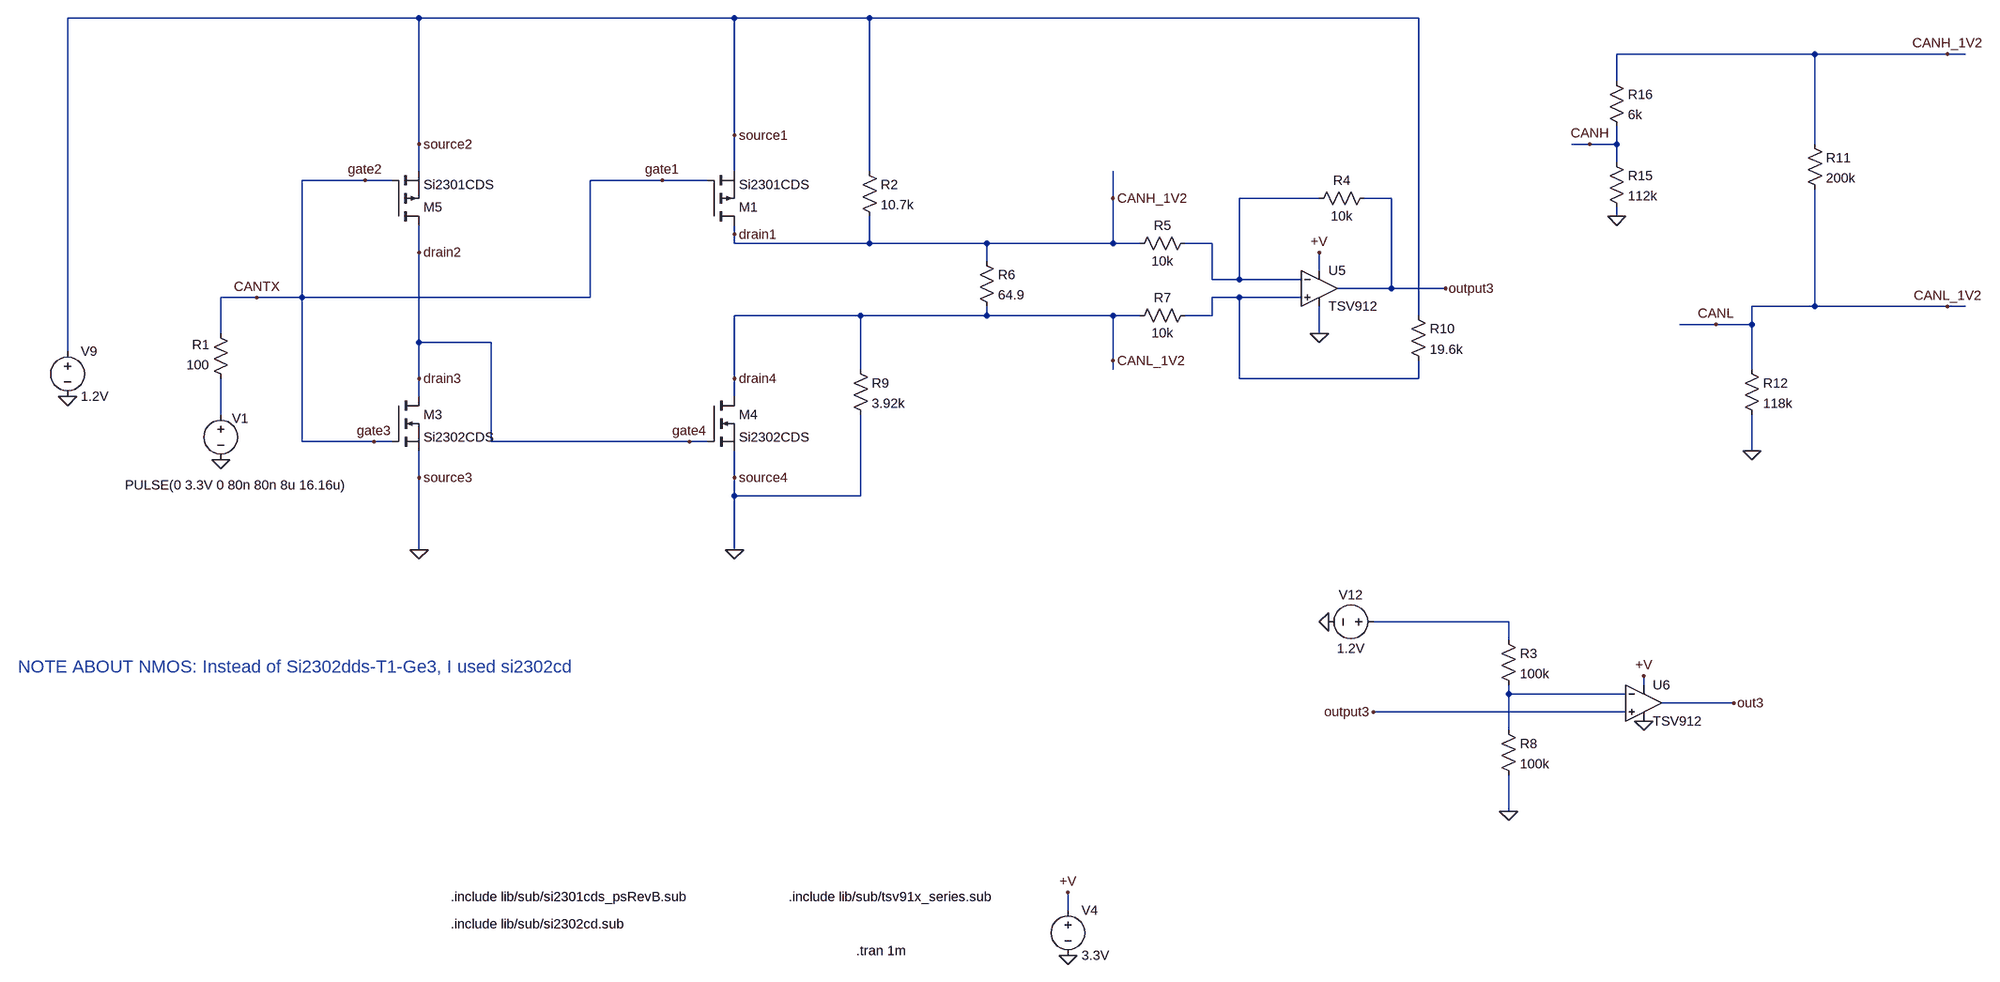
[diagram p0: schematic Simulation.asc]
Simulation.asc, the LTspice schematic file:
Version 4.1
SHEET 1 3984 680
WIRE -496 -1248 -1120 -1248
WIRE 64 -1248 -496 -1248
WIRE 304 -1248 64 -1248
WIRE 1280 -1248 304 -1248
WIRE 1984 -1184 1632 -1184
WIRE 2256 -1184 1984 -1184
WIRE 2288 -1184 2256 -1184
WIRE 1632 -1136 1632 -1184
WIRE 64 -1040 64 -1248
WIRE -496 -1024 -496 -1248
WIRE 1584 -1024 1552 -1024
WIRE 1632 -1024 1632 -1056
WIRE 1632 -1024 1584 -1024
WIRE 1984 -1024 1984 -1184
WIRE 1632 -992 1632 -1024
WIRE -496 -976 -496 -1024
WIRE 64 -976 64 -1040
WIRE 304 -976 304 -1248
WIRE -592 -960 -704 -960
WIRE -544 -960 -592 -960
WIRE -64 -960 -192 -960
WIRE 16 -960 -64 -960
WIRE 736 -928 736 -976
WIRE 1104 -928 960 -928
WIRE 1232 -928 1184 -928
WIRE 1632 -896 1632 -912
WIRE 64 -864 64 -880
WIRE 64 -848 64 -864
WIRE 304 -848 304 -896
WIRE 304 -848 64 -848
WIRE 512 -848 304 -848
WIRE 736 -848 736 -928
WIRE 736 -848 512 -848
WIRE 784 -848 736 -848
WIRE 912 -848 864 -848
WIRE -496 -832 -496 -880
WIRE 512 -816 512 -848
WIRE 1104 -800 1104 -832
WIRE 912 -784 912 -848
WIRE 960 -784 960 -928
WIRE 960 -784 912 -784
WIRE 1072 -784 960 -784
WIRE 1232 -768 1232 -928
WIRE 1232 -768 1136 -768
WIRE 1328 -768 1232 -768
WIRE -784 -752 -848 -752
WIRE -704 -752 -704 -960
WIRE -704 -752 -784 -752
WIRE -192 -752 -192 -960
WIRE -192 -752 -704 -752
WIRE 960 -752 912 -752
WIRE 1072 -752 960 -752
WIRE 1984 -736 1984 -944
WIRE 1984 -736 1872 -736
WIRE 2256 -736 1984 -736
WIRE 2288 -736 2256 -736
WIRE 288 -720 64 -720
WIRE 512 -720 512 -736
WIRE 512 -720 288 -720
WIRE 736 -720 512 -720
WIRE 784 -720 736 -720
WIRE 912 -720 912 -752
WIRE 912 -720 864 -720
WIRE 1280 -720 1280 -1248
WIRE 1808 -704 1744 -704
WIRE 1872 -704 1872 -736
WIRE 1872 -704 1808 -704
WIRE -848 -688 -848 -752
WIRE 1104 -688 1104 -736
WIRE -496 -672 -496 -832
WIRE -368 -672 -496 -672
WIRE -1120 -656 -1120 -1248
WIRE 736 -640 736 -720
WIRE 288 -624 288 -720
WIRE 736 -624 736 -640
WIRE 1872 -624 1872 -704
WIRE -496 -608 -496 -672
WIRE 64 -608 64 -720
WIRE 960 -608 960 -752
WIRE 1280 -608 1280 -640
WIRE 1280 -608 960 -608
WIRE -496 -576 -496 -608
WIRE 64 -576 64 -608
WIRE -848 -544 -848 -608
WIRE -704 -496 -704 -752
WIRE -576 -496 -704 -496
WIRE -544 -496 -576 -496
WIRE -368 -496 -368 -672
WIRE -16 -496 -368 -496
WIRE 16 -496 -16 -496
WIRE 1872 -480 1872 -544
WIRE -496 -432 -496 -480
WIRE 64 -432 64 -480
WIRE 64 -400 64 -432
WIRE 288 -400 288 -544
WIRE 288 -400 64 -400
WIRE -496 -304 -496 -432
WIRE 64 -304 64 -400
WIRE 1440 -176 1200 -176
WIRE 1440 -144 1440 -176
WIRE 1680 -64 1680 -80
WIRE 1440 -48 1440 -64
WIRE 1648 -48 1440 -48
WIRE 1840 -32 1712 -32
WIRE 1648 -16 1200 -16
WIRE 1440 16 1440 -48
WIRE 1440 160 1440 96
WIRE 656 336 656 304
FLAG 656 416 0
FLAG 656 304 +V
FLAG 1104 -688 0
FLAG 1104 -832 +V
FLAG -1120 -576 0
FLAG 1328 -768 output3
FLAG 1440 160 0
FLAG 1120 -176 0
FLAG 1680 -80 +V
FLAG 1680 0 0
FLAG 1200 -16 output3
FLAG 1840 -32 out3
FLAG 736 -640 CANL_1V2
FLAG -496 -1024 source2
FLAG -592 -960 gate2
FLAG -848 -464 0
FLAG -576 -496 gate3
FLAG -496 -432 source3
FLAG -496 -608 drain3
FLAG -496 -304 0
FLAG 64 -304 0
FLAG -784 -752 CANTX
FLAG -16 -496 gate4
FLAG 64 -608 drain4
FLAG 64 -432 source4
FLAG 64 -864 drain1
FLAG 64 -1040 source1
FLAG -64 -960 gate1
FLAG 1584 -1024 CANH
FLAG 1632 -896 0
FLAG 1872 -480 0
FLAG 1808 -704 CANL
FLAG 2256 -1184 CANH_1V2
FLAG 2256 -736 CANL_1V2
FLAG -496 -832 drain2
FLAG 736 -928 CANH_1V2
SYMBOL voltage 656 320 R0
WINDOW 123 0 0 Left 0
WINDOW 39 0 0 Left 0
SYMATTR InstName V4
SYMATTR Value 3.3V
SYMBOL res 880 -864 R90
WINDOW 0 0 56 VBottom 2
WINDOW 3 32 56 VTop 2
SYMATTR InstName R5
SYMATTR Value 10k
SYMBOL res 880 -736 R90
WINDOW 0 0 56 VBottom 2
WINDOW 3 32 56 VTop 2
SYMATTR InstName R7
SYMATTR Value 10k
SYMBOL lib\\sym\\TSV912 1104 -768 R0
SYMATTR InstName U5
SYMBOL res 1200 -944 R90
WINDOW 0 0 56 VBottom 2
WINDOW 3 32 56 VTop 2
SYMATTR InstName R4
SYMATTR Value 10k
SYMBOL res 1264 -736 R0
SYMATTR InstName R10
SYMATTR Value 19.6k
SYMBOL voltage -1120 -672 R0
WINDOW 123 0 0 Left 0
WINDOW 39 0 0 Left 0
SYMATTR InstName V9
SYMATTR Value 1.2V
SYMBOL lib\\sym\\TSV912 1680 -32 R0
SYMATTR InstName U6
SYMBOL res 1424 -160 R0
SYMATTR InstName R3
SYMATTR Value 100k
SYMBOL res 1424 0 R0
SYMATTR InstName R8
SYMATTR Value 100k
SYMBOL voltage 1216 -176 R90
WINDOW 0 -32 56 VBottom 2
WINDOW 3 32 56 VTop 2
WINDOW 123 0 0 Left 0
WINDOW 39 0 0 Left 0
SYMATTR InstName V12
SYMATTR Value 1.2V
SYMBOL res 288 -992 R0
SYMATTR InstName R2
SYMATTR Value 10.7k
SYMBOL res 272 -640 R0
SYMATTR InstName R9
SYMATTR Value 3.92k
SYMBOL res 496 -832 R0
SYMATTR InstName R6
SYMATTR Value 64.9
SYMBOL res -832 -592 R180
WINDOW 0 36 76 Left 2
WINDOW 3 36 40 Left 2
SYMATTR InstName R1
SYMATTR Value 100
SYMBOL voltage -848 -560 R0
WINDOW 0 20 23 Left 2
WINDOW 3 -170 141 Left 2
WINDOW 123 0 0 Left 0
WINDOW 39 0 0 Left 0
SYMATTR InstName V1
SYMATTR Value PULSE(0 3.3V 0 80n 80n 8u 16.16u)
SYMBOL lib\\sym\\nmos -544 -576 R0
SYMATTR InstName M3
SYMATTR Value Si2302CDS
SYMATTR Prefix X
SYMBOL lib\\sym\\nmos 16 -576 R0
SYMATTR InstName M4
SYMATTR Value Si2302CDS
SYMATTR Prefix X
SYMBOL lib\\sym\\pmos -544 -880 M180
SYMATTR InstName M5
SYMATTR Value Si2301CDS
SYMATTR Prefix X
SYMBOL res 1616 -1008 R0
SYMATTR InstName R15
SYMATTR Value 112k
SYMBOL res 1616 -1152 R0
SYMATTR InstName R16
SYMATTR Value 6k
SYMBOL res 1968 -1040 R0
SYMATTR InstName R11
SYMATTR Value 200k
SYMBOL res 1856 -640 R0
SYMATTR InstName R12
SYMATTR Value 118k
SYMBOL lib\\sym\\pmos 16 -880 M180
SYMATTR InstName M1
SYMATTR Value Si2301CDS
SYMATTR Prefix X
TEXT 280 408 Left 2 !.tran 1m
TEXT 160 312 Left 2 !.include lib/sub/tsv91x_series.sub
TEXT -440 312 Left 2 !.include lib/sub/si2301cds_psRevB.sub
TEXT -440 360 Left 2 !.include lib/sub/si2302cd.sub
TEXT -1208 -96 Left 3 ;NOTE ABOUT NMOS: Instead of Si2302dds-T1-Ge3, I used si2302cd

The netlist it stands for:
* Simulation.asc
V4 +V 0 3.3V
R5 N001 CANH_1V2 10k
R7 N002 CANL 10k
* U5: TSV912 (symbol lib\sym\TSV912 not available, pins judged from their places): In+=N002 In-=N001 V+=+V V-=0 OUT=output3
R4 output3 N001 10k
R10 source1 N002 19.6k
V9 source1 0 1.2V
* U6: TSV912 (symbol lib\sym\TSV912 not available, pins judged from their places): In+=output3 In-=N005 V+=+V V-=0 OUT=out3
R3 N004 N005 100k
R8 N005 0 100k
V12 N004 0 1.2V
R2 source1 CANH_1V2 10.7k
R9 CANL 0 3.92k
R6 CANH_1V2 CANL 64.9
R1 N003 gate1 100
V1 N003 0 PULSE(0 3.3V 0 80n 80n 8u 16.16u)
X§M3 drain2 gate1 0 Si2302CDS  ; pins D G S
X§M4 CANL drain2 0 Si2302CDS  ; pins D G S
X§M5 drain2 gate1 source1 Si2301CDS  ; pins D G S
R15 CANH 0 112k
R16 CANH_1V2 CANH 6k
R11 CANH_1V2 CANL 200k
R12 CANL 0 118k
X§M1 CANH_1V2 gate1 source1 Si2301CDS  ; pins D G S
.tran 1m
.include lib/sub/tsv91x_series.sub
.include lib/sub/si2301cds_psRevB.sub
.include lib/sub/si2302cd.sub
* NOTE ABOUT NMOS: Instead of Si2302dds-T1-Ge3, I used si2302cd
.backanno
.end